# EAGLE design 3.3V Reference (EAGLE 9.6.2)
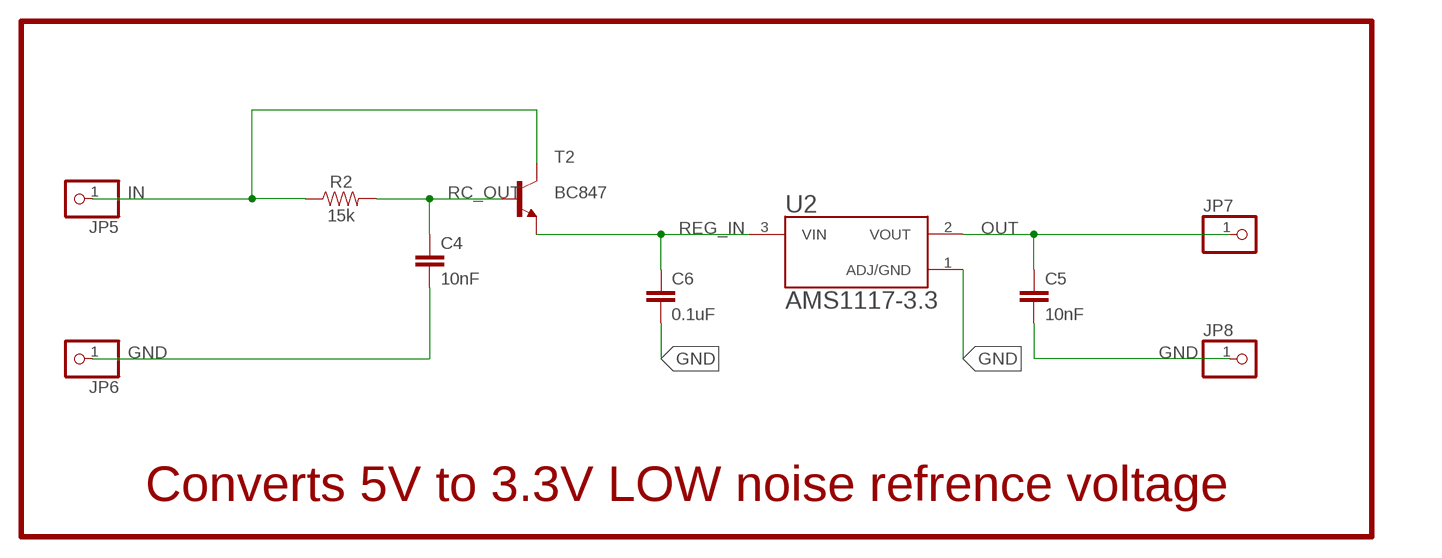
[diagram p0: schematic, sheet 1]

## Parts
C4  10nF  10NF-0603-50V-10%  [0603]
C5  10nF  10NF-0603-50V-10%  [0603]
C6  0.1uF  0.1UF-0603-25V-(+80/-20%)  [0603]
JP5  PINHD-1X1  [1X01]
JP6  PINHD-1X1  [1X01]
JP7  PINHD-1X1  [1X01]
JP8  PINHD-1X1  [1X01]
R2  15k  15KOHM-0603-1/10W-1%  [0603]
T2  BC847  [SOT23]
U2  AMS1117-3.3  [SOT229P700X180-4N]

## Nets
GND: C4.2 C5.2 C6.2 JP6.1 JP8.1 U2.1(ADJ/GND)
IN: JP5.1 R2.1 T2.3(C)
OUT: C5.1 JP7.1 U2.2(VOUT)
RC_OUT: C4.1 R2.2 T2.1(B)
REG_IN: C6.1 T2.2(E) U2.3(VIN)

## Notes on the sheet
- Converts 5V to 3.3V LOW noise refrence voltage

## Library data of the parts
C4 C5 = Capacitors:10NF: 0.01uF/10nF/10,000pF ceramic capacitors A capacitor is a passive two-terminal electrical component used to store electrical energy temporarily in an electric field. CAP-09321; PROD_ID: CAP-00867
C6 = Capacitors:0.1UF: 0.1µF ceramic capacitors A capacitor is a passive two-terminal electrical component used to store electrical energy temporarily in an electric field.; PROD_ID: CAP-00810
JP5-JP8 = adafruit:PINHD-1X1: Pin header 1x1 for 0.1" spacing With round pins
R2 = SparkFun-Resistors:15KOHM: 15kΩ resistor A resistor is a passive two-terminal electrical component that implements electrical resistance as a circuit element. Resistors act to reduce current flow, and, at the same time, act to lower voltage levels within circuits. - Wikipedia; PROD_ID: RES-07854
T2 = BC847:BC847: NPN TRANSISTOR Check availability <https://pricing.snapeda.com/parts/BC847/Rectron/view-part?ref=eda>; AVAILABILITY: In Stock; DESCRIPTION: Trans GP BJT NPN 45V 0.1A 3-Pin SOT-23; MF: Rectron; MP: BC847; PACKAGE: SOT-523 Rectron; PRICE: None; PURCHASE-URL: https://pricing.snapeda.com/search/part/BC847/?ref=eda
U2 = AMS1117-3.3:AMS1117-3.3: Sot223/Pkg 1-Amp 3.3-Volt Low Drop Out Voltage Regulatator Check availability <https://pricing.snapeda.com/parts/AMS1117-3.3/Advanced%20Monolithic%20Systems/view-part?ref=eda>; AVAILABILITY: Not in stock; DESCRIPTION: LDO Voltage Regulators 800MA LDO LINEAR REG; MF: Advanced Monolithic Systems; MP: AMS1117-3.3; PACKAGE: SOT-223 Seeed Technology; PRICE: None

## Board
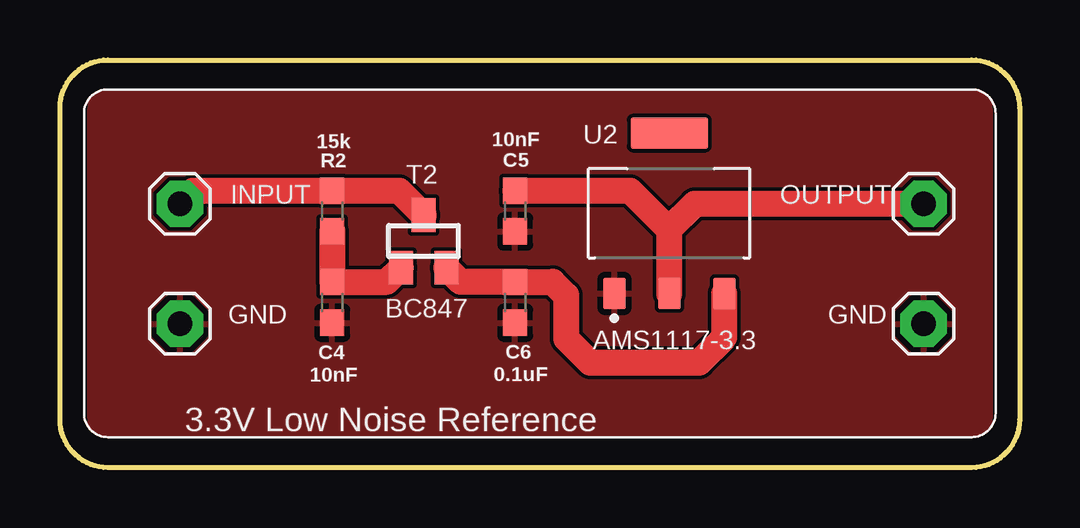
[diagram p1: board, top side]

Size 40 x 17 mm. Coordinates in mm from the lower left corner, seen from the top.
Outline: 2,17 38,17 arc-90 40,15 40,2 arc-90 38,0 2,0 arc-90 0,2 0,15 arc-90 2,17
Copper layers (1*16): Top 0.035mm / dielectric 1.5mm / Bottom 0.035mm
Design rules "default": minimum track width 6mil, minimum drill 0.35mm, track to track 6mil, track to pad 6mil, pad to pad 6mil, via to via 6mil, smd to smd 6mil, copper to edge 40mil, drill to drill 6mil, minimum pad ring 10mil, minimum via ring 8mil, stop-mask expansion 4mil, vias tented up to drill 0mil, thermal gap 10mil

### Footprints (pad centres in the part's own frame; a part is rotated, then mirrored left to right if it is on the bottom)
0603 = smd 1.1 x 1: 1 -0.85,0; 2 0.85,0
1X01 = drill 1.016 pad 1.93 octagon: 1 0,0
SOT23 = smd 1 x 1.4: 1 -0.95,-1.1; 2 0.95,-1.1; 3 0,1.1
SOT229P700X180-4N = smd 0.93 x 1.31: 1 -2.29,-3.345; 2 0,-3.345; 3 2.29,-3.345 | smd 3.24 x 1.31: 4 0,3.345

### Placement (x,y rotation side)
C4  11.35,6.89 270 top
C5  18.97,10.7 270 top
C6  18.97,6.89 270 top
JP5  5,11 0 top
JP6  5,6 0 top
JP7  36,11 0 top
JP8  36,6 0 top
R2  11.35,10.7 270 top
T2  15.16,9.43 0 top
U2  25.4,10.6 0 top

### Tracks (layer width: path | path; a pad name or v marks a point on that pad's centre or on a via)
GND
  pour Top: 2,15.77 38,15.77 arc-90 39,14.77 39,2.27 arc-90 38,1.27 2,1.27 arc-90 1,2.27 1,14.77 arc-90
IN
  Top 1.08: T2.3 14.14,11.55 R2.1 5.55,11.55 JP5.1
OUT
  Top 1.08: C5.1 23.77,11.55 25.39,9.93 | 25.39,9.93 25.39,7.27 U2.2 | 25.39,9.93 26.46,11 JP7.1
RC_OUT
  Top 1.08: R2.2 C4.1 13.62,7.74 T2.1
REG_IN
  Top 1.08: T2.2 16.7,7.74 C6.1 20.54,7.74 21.1,7.18 21.1,5.38 22.1,4.38 26.64,4.38 27.69,5.43 U2.3

### Text on the board
tNames: INPUT | OUTPUT | GND | GND | 3.3V Low Noise Reference
bNames: Input voltage 5V